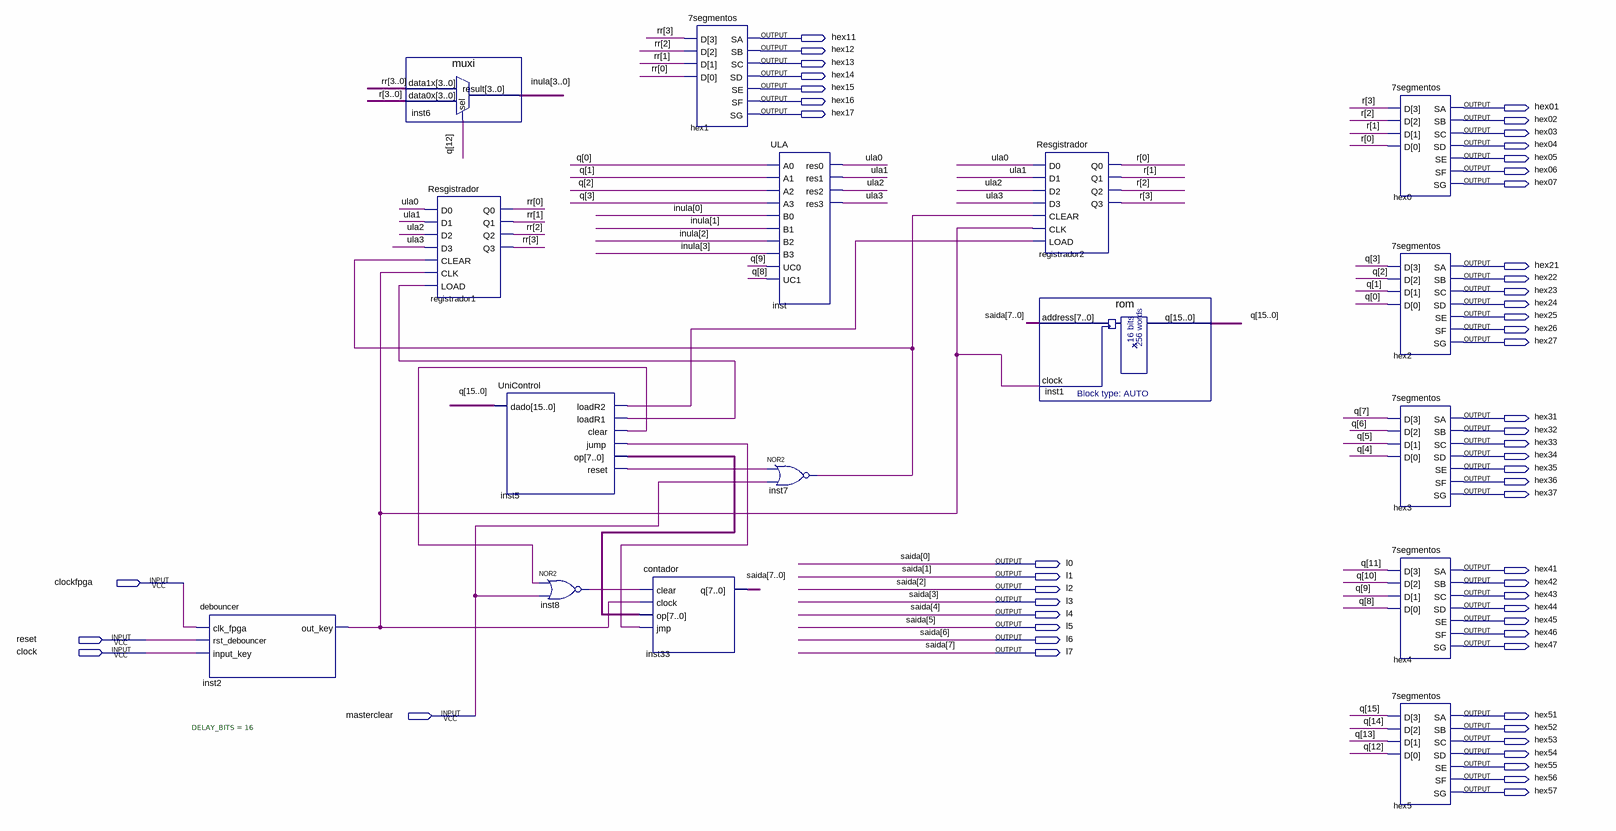
[diagram p0: schematic sheet]
// Quartus schematic cpu.bdf as structural Verilog: 16 symbols, 54 pins
module cpu (
  input  clockfpga,
  input  reset,
  input  clock,
  input  masterclear,
  output hex11,
  output hex12,
  output hex13,
  output hex14,
  output hex15,
  output hex16,
  output hex01,
  output hex17,
  output hex02,
  output hex03,
  output hex04,
  output hex05,
  output hex06,
  output hex07,
  output hex21,
  output hex22,
  output hex23,
  output hex24,
  output hex25,
  output hex26,
  output hex27,
  output hex31,
  output hex32,
  output hex33,
  output hex34,
  output hex35,
  output hex36,
  output hex37,
  output l0,
  output hex41,
  output l1,
  output hex42,
  output l2,
  output hex43,
  output l3,
  output hex44,
  output l4,
  output hex45,
  output l5,
  output hex46,
  output l6,
  output hex47,
  output l7,
  output hex51,
  output hex52,
  output hex53,
  output hex54,
  output hex55,
  output hex56,
  output hex57
);

  wire inst2_out_key, inst5_clear, inst5_jump, inst5_loadr1, inst5_loadr2, inst5_reset, inst7_out, inst8_out,
       ula0, ula1, ula2, ula3;
  wire [3:0] inula, r, rr;
  wire [7:0] inst5_op;
  wire [15:0] q;

  debouncer #(.DELAY_BITS(16)) inst2 (
    .clk_fpga(clockfpga), .rst_debouncer(reset), .input_key(clock), .out_key(inst2_out_key));
  muxi inst6 (.data1x(rr), .data0x(r), .sel(q[12]), .result(inula));
  Resgistrador registrador1 (
    .D0(ula0), .D1(ula1), .D2(ula2), .D3(ula3), .CLEAR(inst7_out), .CLK(inst2_out_key), .LOAD(inst5_loadr1),
    .Q0(rr[0]), .Q1(rr[1]), .Q2(rr[2]), .Q3(rr[3]));
  UniControl inst5 (
    .dado(q), .loadR2(inst5_loadr2), .loadR1(inst5_loadr1), .clear(inst5_clear), .jump(inst5_jump),
    .op(inst5_op), .reset(inst5_reset));
  nor inst8 (inst8_out, inst5_clear, masterclear);
  contador inst33 (
    .clear(inst8_out), .clock(inst2_out_key), .op(inst5_op), .jmp(inst5_jump),
    .q({l7, l6, l5, l4, l3, l2, l1, l0}));
  \7segmentos  hex1 (.D(rr), .SA(hex11), .SB(hex12), .SC(hex13), .SD(hex14), .SE(hex15), .SF(hex16), .SG(hex17));
  ULA inst (
    .A0(q[0]), .A1(q[1]), .A2(q[2]), .A3(q[3]), .B0(inula[0]), .B1(inula[1]), .B2(inula[2]), .B3(inula[3]),
    .UC0(q[9]), .UC1(q[8]), .res0(ula0), .res1(ula1), .res2(ula2), .res3(ula3));
  nor inst7 (inst7_out, inst5_reset, masterclear);
  Resgistrador registrador2 (
    .D0(ula0), .D1(ula1), .D2(ula2), .D3(ula3), .CLEAR(inst7_out), .CLK(inst2_out_key), .LOAD(inst5_loadr2),
    .Q0(r[0]), .Q1(r[1]), .Q2(r[2]), .Q3(r[3]));
  rom inst1 (.address({l7, l6, l5, l4, l3, l2, l1, l0}), .clock(inst2_out_key), .q(q));
  \7segmentos  hex0 (.D(r), .SA(hex01), .SB(hex02), .SC(hex03), .SD(hex04), .SE(hex05), .SF(hex06), .SG(hex07));
  \7segmentos  hex2 (.D(q[3:0]), .SA(hex21), .SB(hex22), .SC(hex23), .SD(hex24), .SE(hex25), .SF(hex26), .SG(hex27));
  \7segmentos  hex3 (.D(q[7:4]), .SA(hex31), .SB(hex32), .SC(hex33), .SD(hex34), .SE(hex35), .SF(hex36), .SG(hex37));
  \7segmentos  hex4 (.D(q[11:8]), .SA(hex41), .SB(hex42), .SC(hex43), .SD(hex44), .SE(hex45), .SF(hex46), .SG(hex47));
  \7segmentos  hex5 (.D(q[15:12]), .SA(hex51), .SB(hex52), .SC(hex53), .SD(hex54), .SE(hex55), .SF(hex56), .SG(hex57));

  // Other names for the same wires on the sheet: saida[7:0] = {l7, l6, l5, l4, l3, l2, l1, l0}
endmodule
